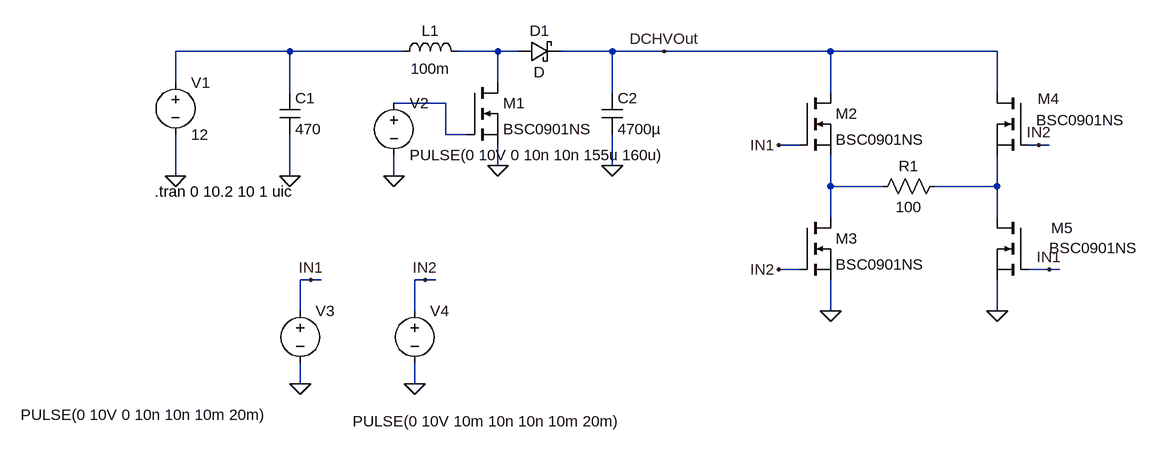
[diagram p0: schematic boostinverter.asc]
boostinverter.asc, the LTspice schematic file:
Version 4
SHEET 1 1004 680
WIRE -304 -32 -480 -32
WIRE -128 -32 -304 -32
WIRE 16 -32 -48 -32
WIRE 48 -32 16 -32
WIRE 192 -32 112 -32
WIRE 272 -32 192 -32
WIRE 528 -32 272 -32
WIRE 784 -32 528 -32
WIRE -480 16 -480 -32
WIRE 16 16 16 -32
WIRE -304 32 -304 -32
WIRE 192 32 192 -32
WIRE 528 32 528 -32
WIRE 784 32 784 -32
WIRE -64 48 -144 48
WIRE -64 96 -64 48
WIRE -32 96 -64 96
WIRE 480 112 448 112
WIRE 848 112 832 112
WIRE 864 112 848 112
WIRE 16 144 16 112
WIRE 192 144 192 96
WIRE -480 160 -480 96
WIRE -304 160 -304 96
WIRE -144 160 -144 128
WIRE 528 176 528 128
WIRE 608 176 528 176
WIRE 784 176 784 128
WIRE 784 176 688 176
WIRE 528 224 528 176
WIRE 784 224 784 176
WIRE 480 304 448 304
WIRE 864 304 832 304
WIRE 880 304 864 304
WIRE -272 320 -288 320
WIRE -256 320 -272 320
WIRE -96 320 -112 320
WIRE -80 320 -96 320
WIRE -288 368 -288 320
WIRE -112 368 -112 320
WIRE 528 368 528 320
WIRE 784 368 784 320
WIRE -288 480 -288 448
WIRE -112 480 -112 448
FLAG 192 144 0
FLAG 16 144 0
FLAG -304 160 0
FLAG -480 160 0
FLAG -144 160 0
FLAG 272 -32 DCHVOut
FLAG 528 368 0
FLAG 784 368 0
FLAG -112 480 0
FLAG -288 480 0
FLAG -272 320 IN1
FLAG -96 320 IN2
FLAG 448 112 IN1
FLAG 864 304 IN1
FLAG 448 304 IN2
FLAG 848 112 IN2
SYMBOL nmos -32 16 R0
SYMATTR InstName M1
SYMATTR Value BSC0901NS
SYMBOL ind -144 -16 R270
WINDOW 0 32 56 VTop 2
WINDOW 3 5 56 VBottom 2
SYMATTR InstName L1
SYMATTR Value 100m
SYMBOL schottky 48 -16 R270
WINDOW 0 32 32 VTop 2
WINDOW 3 0 32 VBottom 2
SYMATTR InstName D1
SYMBOL cap 176 32 R0
SYMATTR InstName C2
SYMATTR Value 4700µ
SYMBOL voltage -480 0 R0
WINDOW 123 0 0 Left 2
WINDOW 39 0 0 Left 2
SYMATTR InstName V1
SYMATTR Value 12
SYMBOL voltage -144 32 R0
WINDOW 123 0 0 Left 2
WINDOW 39 0 0 Left 2
SYMATTR InstName V2
SYMATTR Value PULSE(0 10V 0 10n 10n 155u 160u)
SYMBOL cap -320 32 R0
SYMATTR InstName C1
SYMATTR Value 470
SYMBOL nmos 480 32 R0
SYMATTR InstName M2
SYMATTR Value BSC0901NS
SYMBOL nmos 480 224 R0
SYMATTR InstName M3
SYMATTR Value BSC0901NS
SYMBOL nmos 832 32 M0
WINDOW 0 -48 9 Left 2
WINDOW 3 -148 42 Left 2
SYMATTR InstName M4
SYMATTR Value BSC0901NS
SYMBOL nmos 832 224 M0
WINDOW 0 -69 16 Left 2
WINDOW 3 -168 47 Left 2
SYMATTR InstName M5
SYMATTR Value BSC0901NS
SYMBOL res 592 192 R270
WINDOW 0 32 56 VTop 2
WINDOW 3 0 56 VBottom 2
SYMATTR InstName R1
SYMATTR Value 100
SYMBOL voltage -288 352 R0
WINDOW 123 0 0 Left 2
WINDOW 39 0 0 Left 2
WINDOW 3 -430 176 Left 2
SYMATTR Value PULSE(0 10V 0 10n 10n 10m 20m)
SYMATTR InstName V3
SYMBOL voltage -112 352 R0
WINDOW 123 0 0 Left 2
WINDOW 39 0 0 Left 2
WINDOW 3 -95 186 Left 2
SYMATTR Value PULSE(0 10V 10m 10n 10n 10m 20m)
SYMATTR InstName V4
TEXT -512 184 Left 2 !.tran 0 10.2 10 1 uic

The netlist it stands for:
* boostinverter.asc
M1 N002 N003 0 0 BSC0901NS
L1 N001 N002 100m
D1 N002 DCHVOut D
C2 DCHVOut 0 4700µ
V1 N001 0 12
V2 N003 0 PULSE(0 10V 0 10n 10n 155u 160u)
C1 N001 0 470
M2 DCHVOut IN1 N004 N004 BSC0901NS
M3 N004 IN2 0 0 BSC0901NS
M4 DCHVOut IN2 N005 N005 BSC0901NS
M5 N005 IN1 0 0 BSC0901NS
R1 N004 N005 100
V3 IN1 0 PULSE(0 10V 0 10n 10n 10m 20m)
V4 IN2 0 PULSE(0 10V 10m 10n 10n 10m 20m)
.model D D
.lib standard.dio
.model NMOS NMOS
.model PMOS PMOS
.lib standard.mos
.tran 0 10.2 10 1 uic
.backanno
.end